# Altium schematic sheet NRF24l01.SchDoc
size A2; SheetNumber: 5; SheetTotal: 12
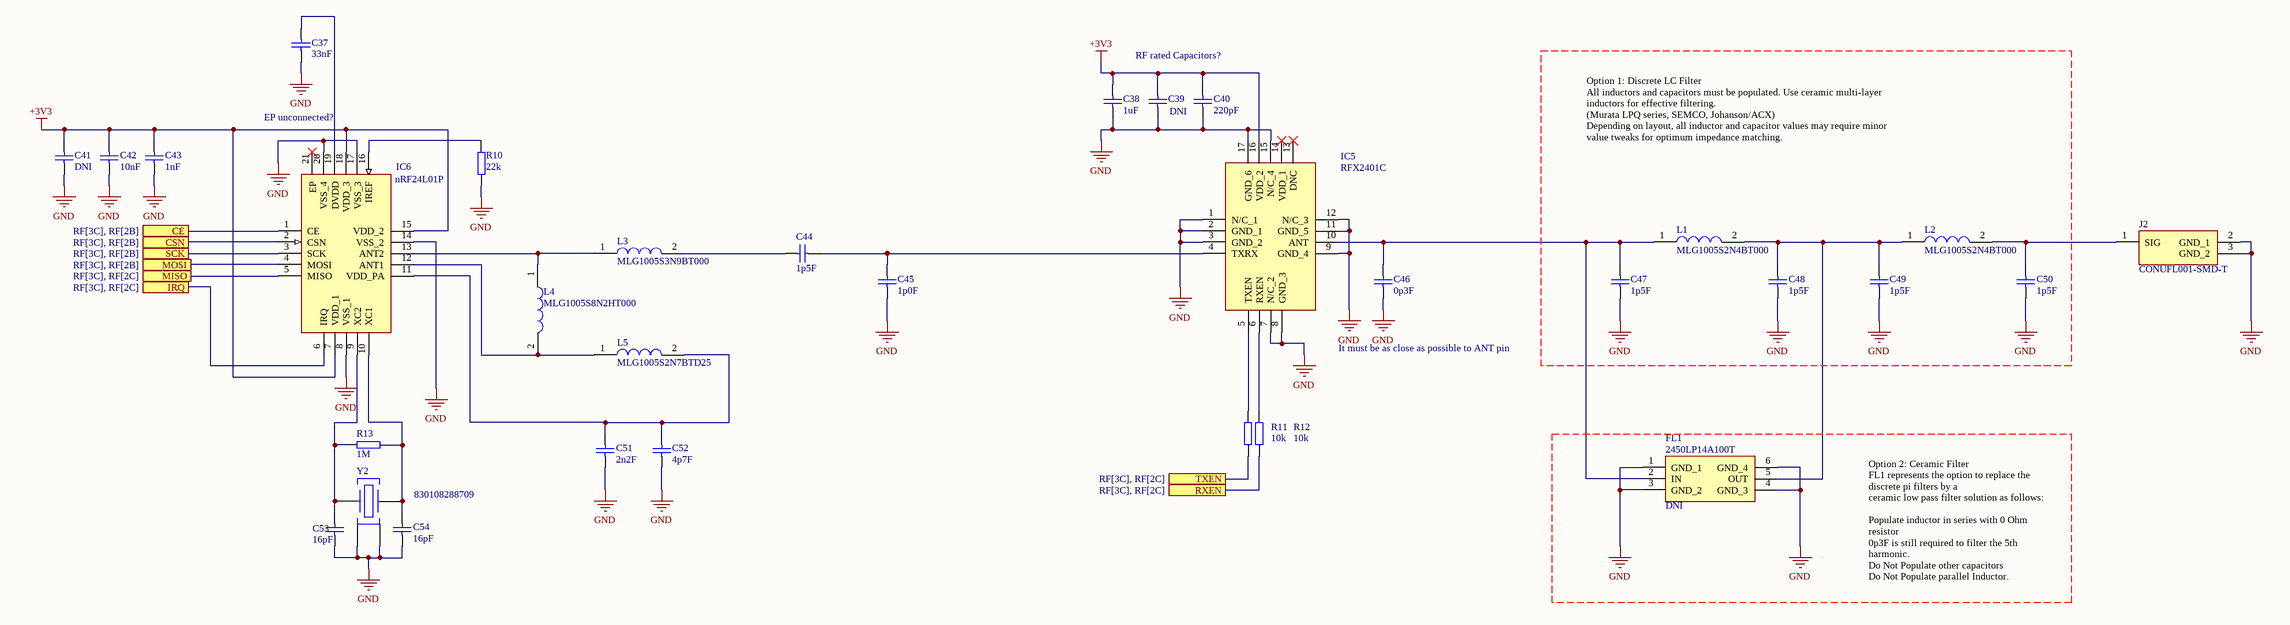
[diagram p0: NRF24l01.SchDoc]

## Parts
C37  value 33nF  [CAP0402]  (hidden comment: Cap0402)
C38  value 1uF  [CAP0402]  (hidden comment: Cap0402)
C39  value DNI  [CAP0402]  (hidden comment: Cap0402)
C40  value 220pF  [CAP0402]  (hidden comment: Cap0402)
C41  value DNI  [CAP0402]  (hidden comment: Cap0402)
C42  value 10nF  [CAP0402]  (hidden comment: Cap0402)
C43  value 1nF  [CAP0402]  (hidden comment: Cap0402)
C44  value 1p5F  [CAP0402]  (hidden comment: Cap0402)
C45  value 1p0F  [CAP0402]  (hidden comment: Cap0402)
C46  value 0p3F  [CAP0402]  (hidden comment: Cap0402)
C47  value 1p5F  [CAP0402]  (hidden comment: Cap0402)
C48  value 1p5F  [CAP0402]  (hidden comment: Cap0402)
C49  value 1p5F  [CAP0402]  (hidden comment: Cap0402)
C50  value 1p5F  [CAP0402]  (hidden comment: Cap0402)
C51  value 2n2F  [CAP0402]  (hidden comment: Cap0402)
C52  value 4p7F  [CAP0402]  (hidden comment: Cap0402)
C53  value 16pF  [CAP0402]  (hidden comment: Cap0402)
C54  value 16pF  [CAP0402]  (hidden comment: Cap0402)
FL1  2450LP14A100T  value DNI  [2450LP14A100T]
IC5  RFX2401C  [QFN50P300X300X60-17N-D]
IC6  nRF24L01P  [QFN50P400X400X95-21N-D]
J2  CONUFL001-SMD-T  [CONUFL001-SMD]
L1  MLG1005S2N4BT000  [MLG1005]
L2  MLG1005S2N4BT000  [MLG1005]
L3  MLG1005S3N9BT000  [MLG1005]
L4  MLG1005S8N2HT000  [MLG1005]
L5  MLG1005S2N7BTD25  [MLG1005]
R10  value 22k  [RES0402]  (hidden comment: Res0402)
R11  value 10k  [RES0402]  (hidden comment: Res0402)
R12  value 10k  [RES0402]  (hidden comment: Res0402)
R13  value 1M  [RES0402]  (hidden comment: Res0402)
Y2  830108288709  [830108288709]

## Ports
CE (see RF[3C], RF[2B]), CSN (see RF[3C], RF[2B]), IRQ (see RF[3C], RF[2C]), MISO (see RF[3C], RF[2C]), MOSI (see RF[3C], RF[2B]), RXEN (see RF[3C], RF[2C]), SCK (see RF[3C], RF[2B]), TXEN (see RF[3C], RF[2C])

## Nets
+3V3: C38.2 C39.2 C40.2 C41.2 C42.2 C43.2 IC5.16(VDD_2) IC6.7(VDD_1) IC6.15(VDD_2) IC6.18(VDD_3)
GND: C37.1 C38.1 C39.1 C40.1 C41.1 C42.1 C43.1 C45.1 C46.1 C47.1 C48.1 C49.1 C50.1 C51.1 C52.1 C53.1 C54.1 FL1.1(GND_1) FL1.3(GND_2) FL1.4(GND_3) FL1.6(GND_4) IC5.1(N/C_1) IC5.2(GND_1) IC5.3(GND_2) IC5.7(N/C_2) IC5.8(GND_3) IC5.9(GND_4) IC5.11(GND_5) IC5.12(N/C_3) IC5.15(N/C_4) IC5.17(GND_6) IC6.8(VSS_1) IC6.14(VSS_2) IC6.17(VSS_3) IC6.20(VSS_4) J2.2(GND_1) J2.3(GND_2) R10.1 Y2.2(GND_1) Y2.4(GND_2)
CE: IC6.1(CE) ; port CE
CSN: IC6.2(CSN) ; port CSN
IRQ: IC6.6(IRQ) ; port IRQ
MISO: IC6.5(MISO) ; port MISO
MOSI: IC6.4(MOSI) ; port MOSI
RXEN: R12.1 ; port RXEN
SCK: IC6.3(SCK) ; port SCK
TXEN: R11.1 ; port TXEN
NetC37_2: C37.2 IC6.19(DVDD)
NetC44_1: C44.1 C45.2 IC5.4(TXRX)
NetC44_2: C44.2 L3.2
NetC46_2: C46.2 C47.2 FL1.2(IN) IC5.10(ANT) L1.1
NetC48_2: C48.2 C49.2 FL1.5(OUT) L1.2 L2.1
NetC50_2: C50.2 J2.1(SIG) L2.2
NetC51_2: C51.2 C52.2 IC6.11(VDD_PA) L5.2
NetC53_2: C53.2 IC6.9(XC2) R13.1 Y2.1(CRYSTAL_1)
NetC54_2: C54.2 IC6.10(XC1) R13.2 Y2.3(CRYSTAL_2)
NetIC5_5: IC5.5(TXEN) R11.2
NetIC5_6: IC5.6(RXEN) R12.2
NetIC6_12: IC6.12(ANT1) L4.2 L5.1
NetIC6_13: IC6.13(ANT2) L3.1 L4.1
NetIC6_16: IC6.16(IREF) R10.2

Not connected (* = marked no-connect by the designer): IC5 13(DNC)* 14(VDD_1)*; IC6 21(EP)*

## Notes on the sheet
- RF rated Capacitors?
- EP unconnected?
- Option 1: Discrete LC Filter
  All inductors and capacitors must be populated. Use ceramic multi-layer
  inductors for effective filtering.
  (Murata LPQ series, SEMCO, Johanson/ACX)
  Depending on layout, all inductor and capacitor values may require minor
  value tweaks for optimum impedance matching.
- It must be as close as possible to ANT pin
- Type @ to refer to a designator
- Option 2: Ceramic Filter
  FL1 represents the option to replace the discrete pi filters by a
  ceramic low pass filter solution as follows:
  Populate inductor in series with 0 Ohm resistor
  0p3F is still required to filter the 5th harmonic.
  Do Not Populate other capacitors
  Do Not Populate parallel Inductor.

## Library data of the parts
C37-C43 = Cap0402: Voltage: 6V3
C44-C52 = Cap0402: RF NP0; Voltage: 6V3
C53 C54 = Cap0402: NP0; Voltage: 6V3
FL1 = 2450LP14A100T: Filter; Manufacturer_Name: JOHANSON TECHNOLOGY; Datasheet Link: https://componentsearchengine.com/Datasheets/1/2450LP14A100T.pdf; Height: 0.7mm; Manufacturer_Part_Number: 2450LP14A100T; Arrow Part Number: 2450LP14A100T; Arrow Price/Stock: https://www.arrow.com/en/products/2450lp14a100t/johanson-dielectrics?region=nac
IC5 = RFX2401C: Integrated Circuit; Manufacturer_Name: Skyworks; Datasheet Link: https://eu.mouser.com/datasheet/2/472/RFX2401C_204359B-1524606.pdf; Height: 0.6mm; Manufacturer_Part_Number: RFX2401C; Arrow Part Number: RFX2401C; Arrow Price/Stock: https://www.arrow.com/en/products/rfx2401c/skyworks-solutions?region=nac
IC6 = nRF24L01P: Integrated Circuit; Manufacturer_Name: Nordic Semiconductor; Height: 0.95mm; Manufacturer_Part_Number: nRF24L01P
J2 = CONUFL001-SMD-T: Connector; Manufacturer_Name: Linx Technologies; Datasheet Link: https://linxtechnologies.com/wp/product/mhf-rf-connectors/; Manufacturer_Part_Number: CONUFL001-SMD-T; Mouser Part Number: 712-CONUFL001-SMD-T; Mouser Price/Stock: https://www.mouser.co.uk/ProductDetail/Linx-Technologies/CONUFL001-SMD-T?qs=EU6FO9ffTwfRdkBeQTdJWQ%3D%3D
L1 L2 = MLG1005S2N4BT000: Inductor; Manufacturer_Name: TDK; Datasheet Link: https://product.tdk.com/system/files/dam/doc/product/inductor/inductor/smd/catalog/inductor_commercial_high-frequency_mlg1005s_en.pdf; Manufacturer_Part_Number: MLG1005S2N4BT000; Arrow Part Number: MLG1005S2N4BT000; Arrow Price/Stock: https://www.arrow.com/en/products/mlg1005s2n4bt000/tdk
L3 = MLG1005S3N9BT000: Inductor; Manufacturer_Name: TDK; Datasheet Link: https://product.tdk.com/system/files/dam/doc/product/inductor/inductor/smd/catalog/inductor_commercial_high-frequency_mlg1005s_en.pdf; Manufacturer_Part_Number: MLG1005S3N9BT000; Arrow Part Number: MLG1005S3N9BT000; Arrow Price/Stock: https://www.arrow.com/en/products/mlg1005s3n9bt000/tdk
L4 = MLG1005S8N2HT000: Inductor; Manufacturer_Name: TDK; Datasheet Link: https://product.tdk.com/system/files/dam/doc/product/inductor/inductor/smd/catalog/inductor_commercial_high-frequency_mlg1005s_en.pdf; Manufacturer_Part_Number: MLG1005S8N2HT000
L5 = MLG1005S2N7BTD25: Inductor; Manufacturer_Name: TDK; Datasheet Link: https://product.tdk.com/system/files/dam/doc/product/inductor/inductor/smd/catalog/inductor_automotive_high-frequency_mlg1005s_en.pdf; Manufacturer_Part_Number: MLG1005S2N7BTD25
Y2 = 830108288709: Crystal or Oscillator; Manufacturer_Name: Wurth Elektronik; Datasheet Link: https://www.we-online.com/catalog/datasheet/830108340709.pdf; Height: 0.5mm; Manufacturer_Part_Number: 830108288709